# EAGLE design Launch-28020_V2 (EAGLE 8.4.0)
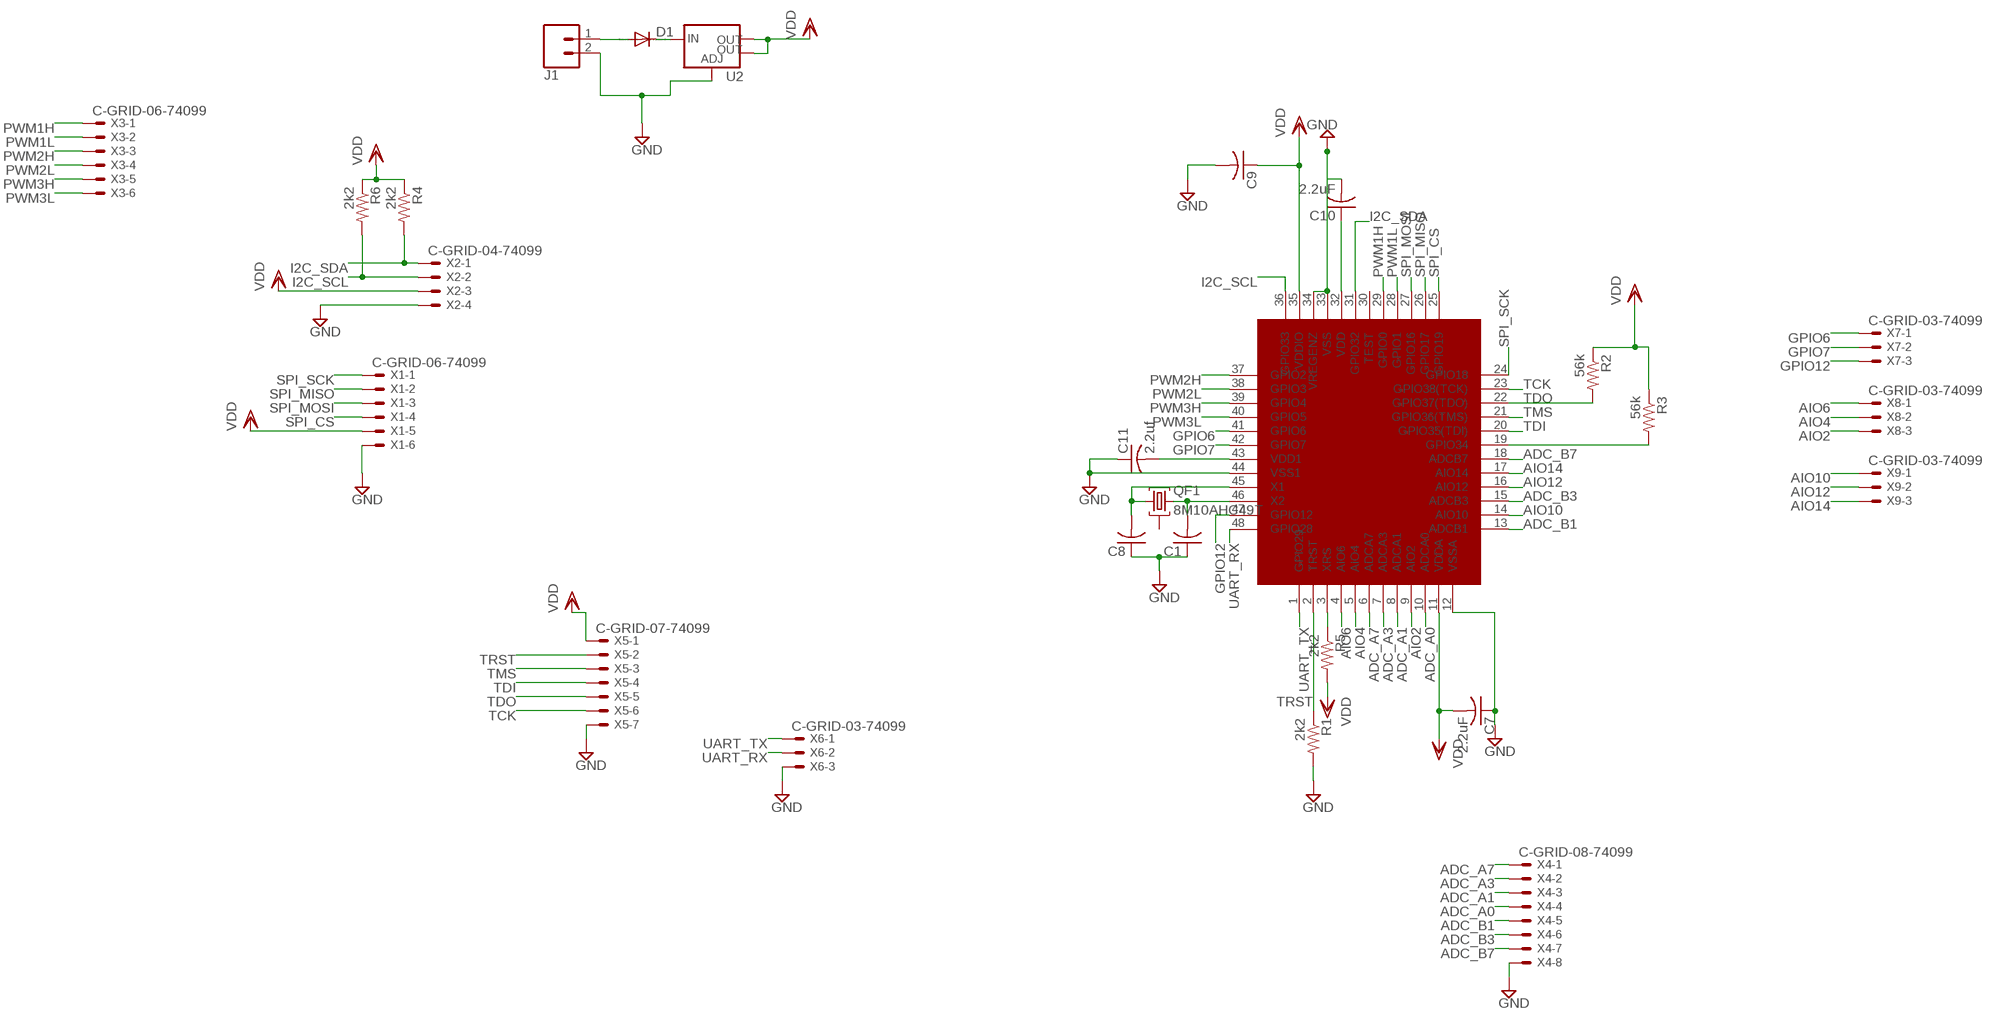
[diagram p0: schematic, sheet 1]

## Parts
C1  C-USC1206  [C1206]
C7  2.2uF  C-USC1206  [C1206]
C8  C-USC1206  [C1206]
C9  C-USC1206  [C1206]
C10  2.2uF  C-USC1206  [C1206]
C11  2.2uf  C-USC1206  [C1206]
D1  DIODE-SOD106-W  [SOD106-W]
J1  CONN_023.5MM-NO_SILK  [SCREWTERMINAL-3.5MM-2-NS]
QF1  8M10AHC49T  [HC49U]
R1  2k2  R-US_M1206  [M1206]
R2  56k  R-US_M1206  [M1206]
R3  56k  R-US_M1206  [M1206]
R4  2k2  R-US_M1206  [M1206]
R5  2k2  R-US_M1206  [M1206]
R6  2k2  R-US_M1206  [M1206]
U2  V_REG_LM1117SOT223  [SOT223]
U$1  TMS320F28020  [LQFP-48]
X1  C-GRID-06-74099  [74099-06]
X2  C-GRID-04-74099  [74099-04]
X3  C-GRID-06-74099  [74099-06]
X4  C-GRID-08-74099  [74099-08]
X5  C-GRID-07-74099  [74099-07]
X6  C-GRID-03-74099  [74099-03]
X7  C-GRID-03-74099  [74099-03]
X8  C-GRID-03-74099  [74099-03]
X9  C-GRID-03-74099  [74099-03]

## Nets
ADC_A0: U$1.10(ADCA0) X4.4
ADC_A1: U$1.8(ADCA1) X4.3
ADC_A3: U$1.7(ADCA3) X4.2
ADC_A7: U$1.6(ADCA7) X4.1
ADC_B1: U$1.13(ADCB1) X4.5
ADC_B3: U$1.15(ADCB3) X4.6
ADC_B7: U$1.18(ADCB7) X4.7
AIO2: U$1.9(AIO2) X8.3
AIO4: U$1.5(AIO4) X8.2
AIO6: U$1.4(AIO6) X8.1
AIO10: U$1.14(AIO10) X9.1
AIO12: U$1.16(AIO12) X9.2
AIO14: U$1.17(AIO14) X9.3
GND: C1.1 C7.1 C8.1 C9.2 C10.2 C11.1 J1.2 R1.2 U2.1(ADJ) U$1.12(VSSA) U$1.33(VSS) U$1.34(VREGENZ) U$1.44(VSS1) X1.6 X2.4 X4.8 X5.7 X6.3
GPIO6: U$1.41(GPIO6) X7.1
GPIO7: U$1.42(GPIO7) X7.2
GPIO12: U$1.47(GPIO12) X7.3
I2C_SCL: R6.2 U$1.36(GPIO33) X2.2
I2C_SDA: R4.2 U$1.31(GPIO32) X2.1
N$1: D1.A J1.1
N$3: C10.1 U$1.32(VDD)
N$4: C11.2 U$1.43(VDD1)
N$5: R5.1 U$1.3(XRS)
N$6: C8.2 QF1.1 U$1.45(X1)
N$7: C1.2 QF1.3 U$1.46(X2)
N$8: D1.C U2.3(IN)
N$12: R3.2 U$1.19(GPIO34)
PWM1H: U$1.29(GPIO0) X3.1
PWM1L: U$1.28(GPIO1) X3.2
PWM2H: U$1.37(GPIO2) X3.3
PWM2L: U$1.38(GPIO3) X3.4
PWM3H: U$1.39(GPIO4) X3.5
PWM3L: U$1.40(GPIO5) X3.6
SPI_CS: U$1.25(GPIO19) X1.4
SPI_MISO: U$1.26(GPIO17) X1.2
SPI_MOSI: U$1.27(GPIO16) X1.3
SPI_SCK: U$1.24(GPIO18) X1.1
TCK: U$1.23(GPIO38(TCK)) X5.6
TDI: U$1.20(GPIO35(TDI)) X5.4
TDO: R2.2 U$1.22(GPIO37(TDO)) X5.5
TMS: U$1.21(GPIO36(TMS)) X5.3
TRST: R1.1 U$1.2(TRST) X5.2
UART_RX: U$1.48(GPIO28) X6.2
UART_TX: U$1.1(GPIO29) X6.1
VDD: C7.2 C9.1 R2.1 R3.1 R4.1 R5.2 R6.1 U2.2(OUT) U2.4(OUT) U$1.11(VDDA) U$1.35(VDDIO) X1.5 X2.3 X5.1
Unconnected: QF1.2 U$1.30(TEST)

## Library data of the parts
C1 C7-C11 = rcl:C-US: CAPACITOR, American symbol
D1 = diode:DIODE-: DIODE
J1 = SparkFun-Connectors:CONN_02: Multi connection point. Often used as Generic Header-pin footprint for 0.1 inch spaced/style header connections On any of the 0.1 inch spaced packages, you can populate with these: Break Away Headers - Straight <https://www.sparkfun.com/products/116> (PRT-00116) Break Away Male Headers - Right Angle <https://www.sparkfun.com/products/553> (PRT-00553) Female Headers <https://www.sparkfun.com/products/115> (PRT-00115) Break Away Headers - Machine Pin <https://www.sparkfun.com/products/117> (PRT-00117) Break Away Female Headers - Swiss Machine Pin <https://www.sparkfun.com/products/743> (PRT-00743) For SCREWTERMINALS and SPRING TERMINALS visit here: Screw Terimnals on SparkFun.com <https://www.sparkfun.com/search/results?term=Screw+Terminals> (5mm/3.5mm/2.54mm spacing) This device is also useful as a general connection point to wire up your design to another part of your project. Our various solder wires solder well into these plated through hole pads. Hook-Up Wire - Assortment (Stranded, 22 AWG) <https://www.sparkfun.com/products/11375> (PRT-11375) Hook-Up Wire - Assortment (Solid Core, 22 AWG) <https://www.sparkfun.com/products/11367> (PRT-11367) View the entire wire category on our website here <https://www.sparkfun.com/categories/141> Special notes: Molex polarized connector foot print use with: PRT-08233 with associated crimp pins and housings. 2.54_SCREWTERM for use with PRT-10571. 3.5mm Screw Terminal footprints for PRT-08084 5mm Screw Terminal footprints for use with PRT-08432; PROD_ID: CONN-08399
QF1 = crystal:8M10AHC49T: Monolithic Crystal Filters Source: www.vanlong.com; OC_FARNELL: unknown; OC_NEWARK: unknown
R1-R6 = resistor:R-US_: RESISTOR, American symbol
U2 = SparkFun-IC-Power:V_REG_LM1117: Voltage Regulator LM1117 Standard adjustable voltage regulator but in SMD form. Spark Fun Electronics SKU : COM-00595; PROD_ID: VREG-08170
U$1 = TMS320F28020:TMS320F28020
X1 X3 = con-molex:C-GRID-06: CONNECTOR wire to board 2.54 mm (0.100") pitch header; OC_FARNELL: unknown; OC_NEWARK: unknown
X2 = con-molex:C-GRID-04: CONNECTOR wire to board 2.54 mm (0.100") pitch header; OC_FARNELL: unknown; OC_NEWARK: unknown
X4 = con-molex:C-GRID-08: CONNECTOR wire to board 2.54 mm (0.100") pitch header; OC_FARNELL: unknown; OC_NEWARK: unknown
X5 = con-molex:C-GRID-07: CONNECTOR wire to board 2.54 mm (0.100") pitch header; OC_FARNELL: unknown; OC_NEWARK: unknown
X6-X9 = con-molex:C-GRID-03: CONNECTOR wire to board 2.54 mm (0.100") pitch header; OC_FARNELL: unknown; OC_NEWARK: unknown

## Board
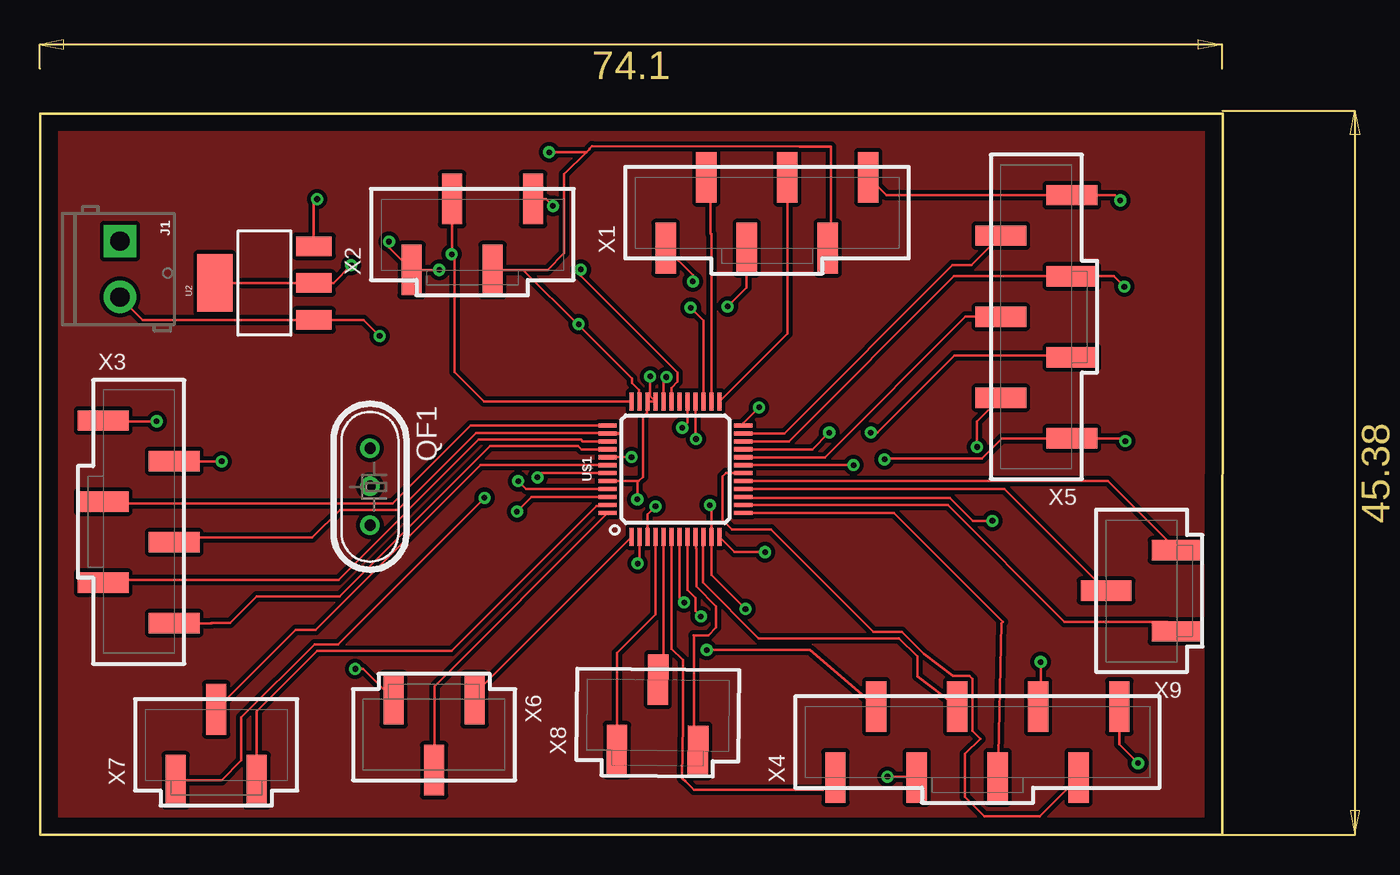
[diagram p1: board, top side]
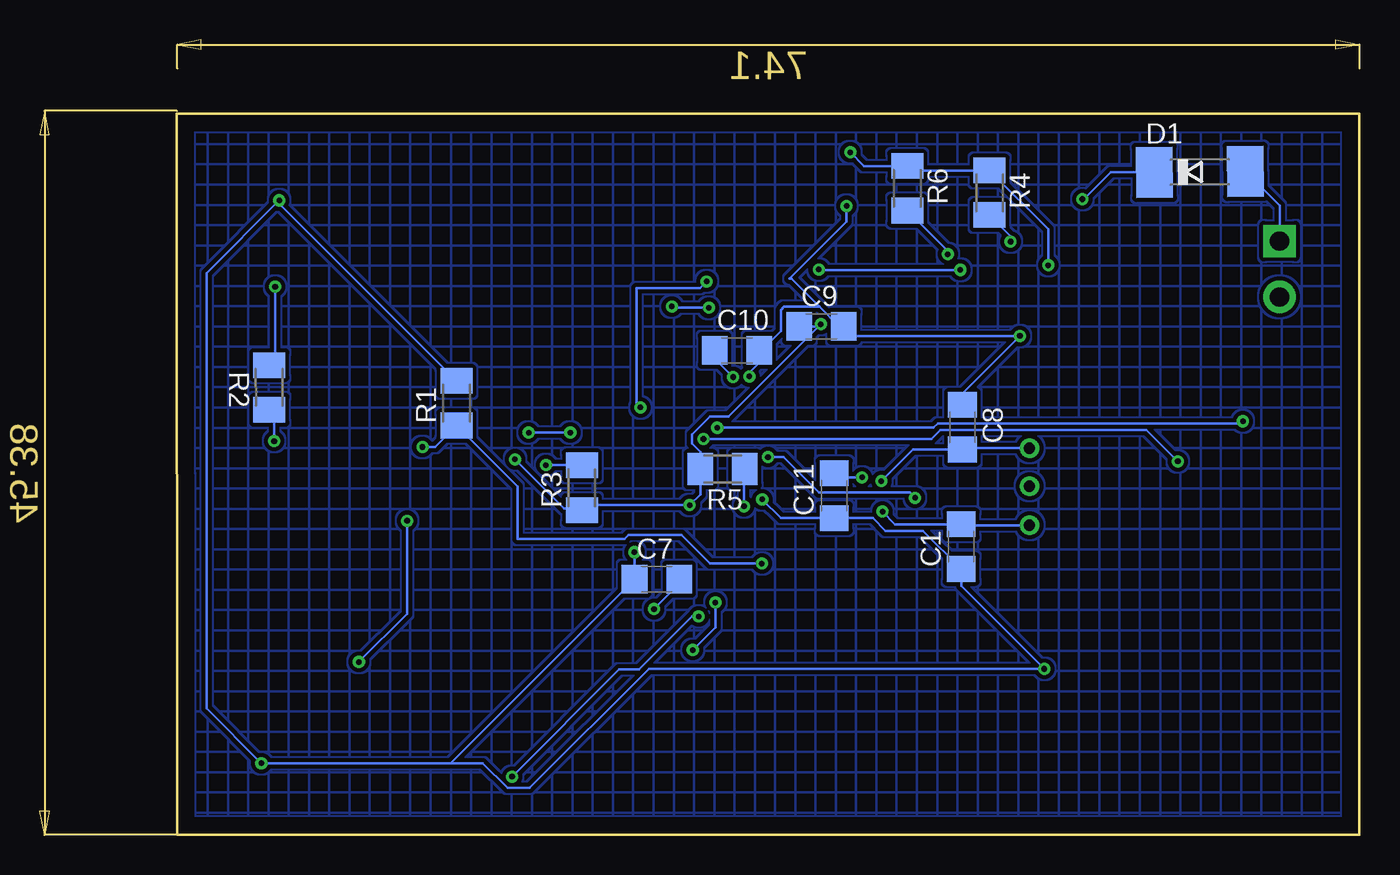
[diagram p2: board, bottom side, seen from below]

Size 74.12 x 45.22 mm. Coordinates in mm from the lower left corner, seen from the top.
Outline: 0,0.01 74.1,0.01 74.12,45.22 0.02,45.22 0.01,0
Copper layers (1*16): Top 0.035mm / dielectric 1.5mm / Bottom 0.035mm
Design rules "default *": minimum track width 6mil, minimum drill 0.35mm, track to track 10mil, track to pad 10mil, pad to pad 6mil, via to via 10mil, smd to smd 6mil, copper to edge 40mil, drill to drill 6mil, minimum pad ring 10mil, minimum via ring 8mil, stop-mask expansion 4mil, vias tented up to drill 0mil, thermal gap 10mil

### Footprints (pad centres in the part's own frame; a part is rotated, then mirrored left to right if it is on the bottom)
C1206 = smd 1.6 x 1.8: 1 -1.4,0; 2 1.4,0
SOD106-W = smd 2.3 x 3.2: A 2.85,0; C -2.85,0
SCREWTERMINAL-3.5MM-2-NS = drill 1.2 pad 2.032 square: 1 0,0 | drill 1.2 pad 2.032: 2 3.5,0
HC49U = drill 0.7 pad 1.2: 1 -2.413,0; 2 -0.027,0; 3 2.413,0
M1206 = smd 1.6 x 2: 1 -1.4,0; 2 1.4,0
SOT223 = smd 1.219 x 2.235: 1 -2.311,-3.099; 2 0,-3.099; 3 2.311,-3.099 | smd 3.6 x 2.2: 4 0,3.099
LQFP-48 = smd 0.254 x 1.143: 1 -2.75,-4.25; 2 -2.25,-4.25; 3 -1.75,-4.25; 4 -1.25,-4.25; 5 -0.75,-4.25; 6 -0.25,-4.25; 7 0.25,-4.25; 8 0.75,-4.25; 9 1.25,-4.25; 10 1.75,-4.25; 11 2.25,-4.25; 12 2.75,-4.25; 25 2.75,4.25; 26 2.25,4.25; 27 1.75,4.25; 28 1.25,4.25; 29 0.75,4.25; 30 0.25,4.25; 31 -0.25,4.25; 32 -0.75,4.25; 33 -1.25,4.25; 34 -1.75,4.25; 35 -2.25,4.25; 36 -2.75,4.25 | smd 1.143 x 0.254: 13 4.25,-2.75; 14 4.25,-2.25; 15 4.25,-1.75; 16 4.25,-1.25; 17 4.25,-0.75; 18 4.25,-0.25; 19 4.25,0.25; 20 4.25,0.75; 21 4.25,1.25; 22 4.25,1.75; 23 4.25,2.25; 24 4.25,2.75; 37 -4.25,2.75; 38 -4.25,2.25; 39 -4.25,1.75; 40 -4.25,1.25; 41 -4.25,0.75; 42 -4.25,0.25; 43 -4.25,-0.25; 44 -4.25,-0.75; 45 -4.25,-1.25; 46 -4.25,-1.75; 47 -4.25,-2.25; 48 -4.25,-2.75
74099-06 = smd 1.27 x 3.175: 1 -6.35,-2.223; 2 -3.81,2.223; 3 -1.27,-2.223; 4 1.27,2.223; 5 3.81,-2.223; 6 6.35,2.223
74099-04 = smd 1.27 x 3.175: 1 -3.81,-2.223; 2 -1.27,2.223; 3 1.27,-2.223; 4 3.81,2.223
74099-08 = smd 1.27 x 3.175: 1 -8.89,-2.223; 2 -6.35,2.223; 3 -3.81,-2.223; 4 -1.27,2.223; 5 1.27,-2.223; 6 3.81,2.223; 7 6.35,-2.223; 8 8.89,2.223
74099-07 = smd 1.27 x 3.175: 1 -7.62,-2.223; 2 -5.08,2.223; 3 -2.54,-2.223; 4 0,2.223; 5 2.54,-2.223; 6 5.08,2.223; 7 7.62,-2.223
74099-03 = smd 1.27 x 3.175: 1 -2.54,-2.223; 2 0,2.223; 3 2.54,-2.223

### Placement (x,y rotation side)
C1  24.97,18.07 90 bottom
C7  44.04,16.02 0 bottom
C8  24.88,25.55 270 bottom
C9  33.72,31.87 0 bottom
C10  39.01,30.37 0 bottom
C11  32.92,21.26 90 bottom
D1  10.01,41.55 0.6 bottom
J1  5.01,37.22 270 top
QF1  20.68,21.82 270 top
R1  56.59,27.06 90 bottom
R2  68.33,28.04 90.1 bottom
R3  48.74,21.76 90 bottom
R4  23.18,40.25 270 bottom
R5  39.92,22.92 180 bottom
R6  28.34,40.53 270 bottom
U2  14.07,34.59 90 top
U$1  39.83,22.92 0 top
X1  45.56,39 0 top
X2  27.1,37.63 0 top
X3  6.18,19.62 270 top
X4  58.75,5.82 0 top
X5  62.45,32.47 90 top
X6  24.7,6.27 180 top
X7  11.04,5.65 0 top
X8  38.72,7.51 359.4 top
X9  69.04,15.3 90 top

### Tracks (layer width: path | path; a pad name or v marks a point on that pad's centre or on a via)
ADC_A0
  Top 0.152: U$1.10 41.54,18.63 41.54,15.82 45.04,12.33 53.84,12.33 55,11.17 55,9.93 X4.4
ADC_A1  (via drill 0.35)
  Top 0.152: U$1.8 40.58,15.35 41.08,14.85 41.08,14.02 v41.41,13.68 | v53.11,3.65 54.89,3.65 X4.3
  Bottom 0.152: v41.41,13.68 41.83,13.68 45.15,10.36 46.4,10.36 v53.11,3.65
ADC_A3  (via drill 0.35)
  Top 0.152: U$1.7 40.08,14.85 v40.37,14.56 | v41.79,11.59 48.26,11.59 X4.2
  Bottom 0.152: v40.37,14.56 40.37,13.01 v41.79,11.59
ADC_A7
  Top 0.152: U$1.6 39.58,11.67 40.29,10.95 40.29,7 40.29,6.99 40.25,3.54 40.44,3.35 40.47,3.35 41,2.81 49.08,2.81 X4.1
ADC_B1
  Top 0.152: U$1.13 53.52,20.17 60.34,13.34 60.26,13.26 X4.5
ADC_B3  (via drill 0.35)
  Top 0.152: U$1.15 44.12,21.12 57.02,21.12 58.45,19.69 v59.69,19.69 | v62.71,10.83 62.71,8.19 X4.6
  Bottom 0.152: v59.69,19.69 59.69,13.86 v62.71,10.83
ADC_B7
  Top 0.152: X4.7 62.68,1.17 59.19,1.17 57.98,2.39 57.98,5.07 58.93,6.02 58.45,6.5 58.45,9.76 58.25,9.96 57.22,9.96 55.4,11.34 54.01,12.73 52.23,12.73 45.81,19.15 43.38,19.15 42.79,19.74 42.79,22.47 42.98,22.67 U$1.18
AIO2
  Top 0.152: 41.08,5.41 X8.3 40.99,5.5 40.99,12.47 40.95,12.51 41.88,12.51 42.37,13 42.37,14.33 41.14,15.57 41.14,17.94 41.12,17.96 41.12,18.62 U$1.9
AIO4
  Top 0.152: U$1.5 39.08,10.07 X8.2
AIO6
  Top 0.152: U$1.4 38.58,13.82 36.18,11.42 36.18,5.33 X8.1
AIO10
  Top 0.152: U$1.14 56.9,20.67 64.2,13.36 70.66,13.36 X9.1
AIO12
  Top 0.152: U$1.16 60.45,21.67 X9.2
AIO14
  Top 0.152: U$1.17 66.94,22.17 X9.3
GND  (via drill 0.35)
  Top 0.152: J1.2 6.45,32.28 U2.1 20.28,32.28 v21.28,31.27 | 38.11,27.17 U$1.33 38.25,27.5 v38.25,28.73 | 38.11,27.17 U$1.34 | X6.3 20.26,10.4 v19.75,10.4 | 37.43,22.17 U$1.44 | 37.43,22.17 37.51,22.17 37.78,22.43 37.78,26.21 38.03,26.46 38.03,27.09 38.11,27.17 | X1.6 53.03,40.09 X5.7 67.38,40.09 v67.7,39.77 | v32.15,39.42 31.71,39.85 X2.4 | v68.82,4.49 67.64,5.67 X4.8 | v37.43,21.03 37.43,22.17 | U$1.12 43.53,17.72 v45.44,17.72
  Bottom 0.152: 37.61,30.22 C10.2 | 37.61,30.22 37.61,29.61 38.49,28.73 v38.25,28.73 | C8.1 24.88,27.68 v21.28,31.27 31.73,31.27 C9.2 32.62,31.87 33.85,33.1 | 37.61,30.22 36.25,31.58 36.25,32.91 36.06,33.1 33.85,33.1 | 33.85,33.1 35.61,34.87 35.72,34.87 32.15,38.44 v32.15,39.42 | 57.02,4.49 v68.82,4.49 72.26,7.93 72.26,35.21 v67.7,39.77 67.7,39.57 R1.2 | 57.02,4.49 56.97,4.49 C7.1 v45.44,17.71 v45.44,17.72 | v37.43,21.03 36.27,19.86 C11.1 30.5,19.86 29.7,19.06 27.36,19.06 C1.1 24.96,15.61 v19.75,10.4 44.54,10.4 52,2.94 53.4,2.94 54.96,4.49 57.02,4.49
GPIO6  (via drill 0.35)
  Top 0.152: v27.86,21.13 18.68,11.95 17.21,11.95 12.62,7.36 12.62,4.66 11.38,3.42 X7.1 | U$1.41 35.59,23.68 v37.07,23.68
  Bottom 0.152: v27.86,21.13 28.19,21.46 33.89,21.46 36.11,23.68 v37.07,23.68
GPIO7
  Top 0.152: U$1.42 27.6,23.17 17.29,12.86 16.03,12.86 X7.2
GPIO12
  Top 0.152: U$1.47 35.53,20.62 34.87,20.62 25.79,11.54 17.38,11.54 13.58,7.75 X7.3
I2C_SCL  (via drill 0.35)
  Top 0.152: 25.83,36.42 v25.8,36.4 | 25.83,36.42 X2.2 | U$1.36 27.84,27.17 26,29.01 26,36.25 25.83,36.42
  Bottom 0.152: R6.2 25.8,36.59 v25.8,36.4
I2C_SDA  (via drill 0.35)
  Top 0.152: v21.87,37.19 21.87,36.82 X2.1 v25.02,35.41 v25.03,35.41 | U$1.31 39.58,28.02 39.96,28.4 39.96,28.99 33.89,35.06 v33.89,35.44
  Bottom 0.152: v21.87,37.19 21.87,37.53 R4.2 | v25.03,35.41 33.86,35.41 v33.89,35.44
N$1
  Bottom 0.152: J1.1 5.01,39.44 D1.A
N$2
  pour Top: 0.08,0.03 74.21,0.03 74.21,45.21 -0.03,45.21 -0.03,0.03
N$3  (via drill 0.35)
  Top 0.152: U$1.32 39.08,28.52 v39.26,28.7
  Bottom 0.152: v39.26,28.7 40.41,29.85 C10.1
N$4  (via drill 0.35)
  Top 0.152: v31.18,22.41 31.44,22.67 U$1.43
  Bottom 0.152: C11.2 32.67,22.41 v31.18,22.41
N$5  (via drill 0.35)
  Top 0.152: U$1.3 38.08,20.09 v38.58,20.59
  Bottom 0.152: v38.58,20.59 38.58,22.86 R5.1
N$6  (via drill 0.35)
  Top 0.152: v29.97,22.17 30.47,21.67 U$1.45
  Bottom 0.152: QF1.1 24.8,24.23 C8.2 27.98,24.15 v29.97,22.17
N$7  (via drill 0.35)
  Top 0.152: U$1.46 30.81,21.17 v29.9,20.26
  Bottom 0.152: v29.9,20.26 29.1,19.47 C1.2 24.9,19.41 QF1.3
N$8  (via drill 0.35)
  Top 0.152: v17.37,39.85 17.16,39.64 U2.3
  Bottom 0.152: D1.C 15.59,41.52 17.32,39.8 v17.37,39.84 v17.37,39.85
N$12  (via drill 0.35)
  Top 0.152: U$1.19 50.97,23.17 v50.98,23.18
  Bottom 0.152: v50.98,23.18 48.75,23.18 R3.2
PWM1H  (via drill 0.35)
  Top 0.152: U$1.29 40.58,25.84 v40.25,25.52 | v7.31,25.92 4.01,25.92 X3.1
  Bottom 0.152: v40.25,25.52 26.69,25.52 26.42,25.79 7.44,25.79 v7.31,25.92
PWM1L  (via drill 0.35)
  Top 0.152: U$1.28 41.08,24.85 v41.12,24.81 | v11.39,23.41 8.43,23.41 X3.2
  Bottom 0.152: v41.12,24.81 26.83,24.81 26.25,25.39 13.37,25.39 v11.39,23.41
PWM2H
  Top 0.152: X3.3 4.08,20.77 19.82,20.77 19.83,20.76 22.09,20.76 26.99,25.67 U$1.37
PWM2L
  Top 0.152: U$1.38 35.62,25.12 36.24,25.12 36.24,25.17 27.33,25.17 22.93,20.77 22.83,20.77 22.42,20.36 18.8,20.36 17.06,18.62 8.87,18.62 8.59,18.35 X3.4
PWM3H
  Top 0.152: U$1.39 34,24.67 33.9,24.77 27.5,24.77 18.7,15.97 4.13,15.97 X3.5
PWM3L
  Top 0.152: U$1.40 33.93,24.17 33.73,24.36 28.22,24.36 18.79,14.94 13.59,14.94 11.93,13.27 10.76,13.27 X3.6
S$1
  pour Bottom (hatched): 0.01,45.22 74.13,45.38 74.1,-0.01 0.01,0.01 0.01,45.22
SPI_CS
  Top 0.152: U$1.25 46.83,31.42 X1.4
SPI_MISO
  Top 0.152: U$1.26 42.08,37.66 42.04,37.7 42.04,40.93 X1.2
SPI_MOSI  (via drill 0.35)
  Top 0.152: U$1.27 41.58,32.24 v40.78,33.04 | v43.1,33.12 44.29,34.32 X1.3
  Bottom 0.152: v40.78,33.04 43.01,33.04 v43.1,33.12
SPI_SCK  (via drill 0.35)
  Top 0.152: X1.1 40.91,35.07 v40.91,34.69 | v45.07,26.79 44.08,25.8 U$1.24
  Bottom 0.152: v40.91,34.69 41.33,34.28 45.31,34.28 45.31,27.03 v45.07,26.79
TCK
  Top 0.152: U$1.23 46.64,25.17 57.19,35.72 58.39,35.72 X5.6
TDI
  Top 0.152: U$1.20 49.19,23.67 57.99,32.47 X5.4
TDO  (via drill 0.35)
  Top 0.152: U$1.22 46.94,24.67 57.28,35.01 64.59,35.01 | 64.59,35.01 X5.5 | v67.96,34.36 67.3,35.01 64.59,35.01
  Bottom 0.152: R2.2 67.96,29.81 v67.96,34.36
TMS  (via drill 0.35)
  Top 0.152: U$1.21 48.42,24.17 v49.46,25.21 | v52.07,25.21 52.48,25.21 57.32,30.05 64.55,30.05 X5.3
  Bottom 0.152: v49.46,25.21 v52.07,25.21
TRST  (via drill 0.35)
  Top 0.152: U$1.2 37.58,17.13 v37.45,17.01 | v58.73,24.31 58.73,25.9 X5.2
  Bottom 0.152: v37.45,17.01 40.7,17.01 42.51,18.81 45.8,18.81 46.07,18.54 52.77,18.54 52.77,21.84 R1.1 57.94,24.31 v58.73,24.31
UART_RX
  Top 0.152: U$1.48 24.72,9.31 24.72,4.85 25.16,4.41 25.06,4.41 X6.2
UART_TX
  Top 0.152: U$1.1 27.24,8.83 X6.1
VDD  (via drill 0.35)
  Top 0.152: U2.4 U2.2 18.39,34.59 v19.51,35.71 | v41.98,20.67 42.08,20.57 U$1.11 42.08,16.29 v44.22,14.15 | U$1.35 37.53,27.21 37.53,27.88 37.09,28.32 37.09,28.61 33.75,31.95 | 33.75,31.95 30.29,35.41 | 30.29,35.41 X2.3 | v33.76,32.01 33.76,31.96 33.75,31.95 | v68.02,24.68 67.85,24.85 X5.1 60.28,24.85 59.02,23.6 52.99,23.6 v52.93,23.54 | X1.5 49.59,38.54 49.59,43.13 47.6,43.14 34.6,43.15 34.45,43 34.44,42.98 34.24,42.79 | 34.24,42.79 32.85,41.4 32.85,36.46 31.81,35.41 30.29,35.41 | v31.91,42.79 34.24,42.79
  Bottom 0.152: v19.51,35.71 19.51,37.97 R4.1 28.06,41.65 R6.1 31.05,41.93 v31.91,42.79 | C9.1 33.9,31.87 v33.76,32.01 39.54,26.23 40.7,26.23 41.82,25.1 41.82,24.52 41.32,24.01 R5.2 41.32,21.33 v41.98,20.67 48.43,20.67 48.63,20.47 | v44.22,14.15 42.64,15.73 C7.2 | 48.63,20.47 R3.1 | v68.02,24.68 68.02,26.34 R2.1 | v52.93,23.54 49.86,20.47 48.63,20.47